# EAGLE design RadioHTC_DISP (EAGLE 7.7.0)
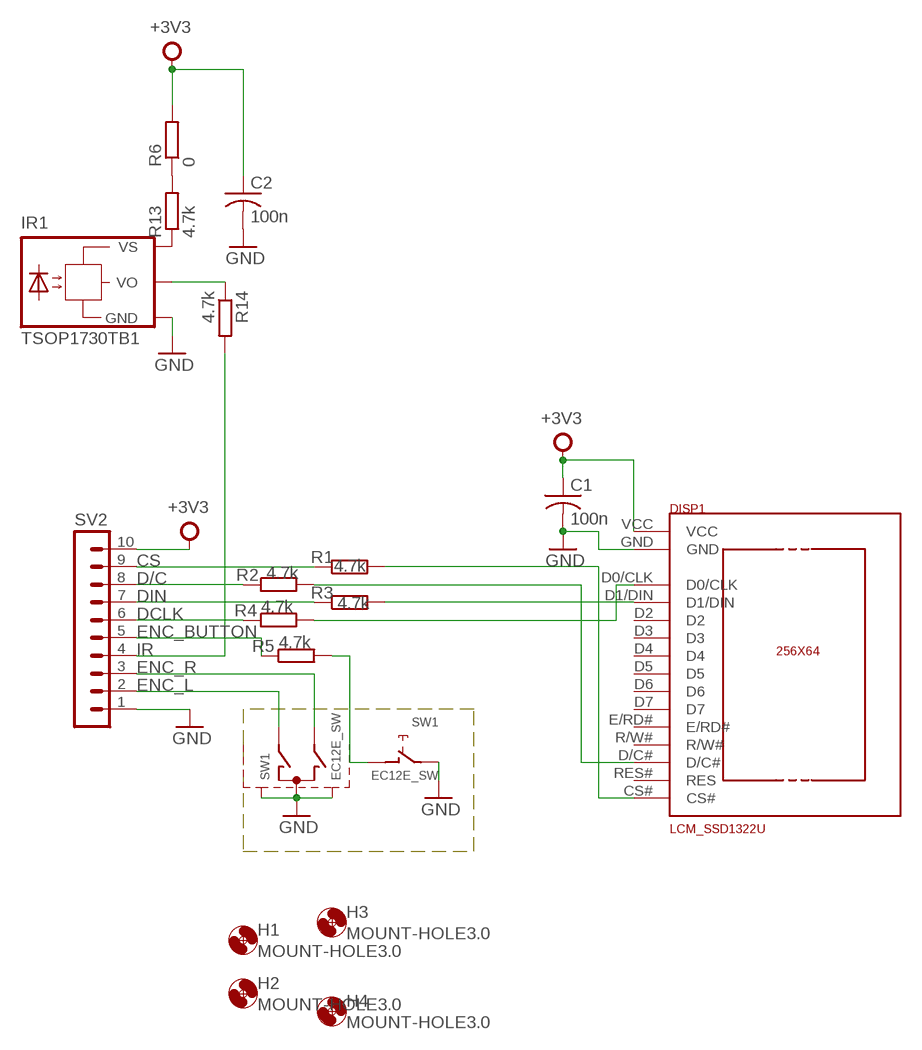
[diagram p0: schematic, sheet 1]

## Parts
C1  100n  C-USC1206  [C1206]
C2  100n  C-USC1206  [C1206]
DISP1  LCM_SSD1322U  [LCM_SSD1322_VERT]
H1  MOUNT-HOLE3.0  [3,0]
H2  MOUNT-HOLE3.0  [3,0]
H3  MOUNT-HOLE3.0  [3,0]
H4  MOUNT-HOLE3.0  [3,0]
IR1  TSOP1730TB1  [TSOP17_TB1]
R1  4.7k  R-EU_R1206  [R1206]
R2  4.7k  R-EU_R1206  [R1206]
R3  4.7k  R-EU_R1206  [R1206]
R4  4.7k  R-EU_R1206  [R1206]
R5  4.7k  R-EU_R1206  [R1206]
R6  0  R-EU_R1206  [R1206]
R13  4.7k  R-EU_R1206  [R1206]
R14  4.7k  R-EU_R1206  [R1206]
SV2  MA10-1  [MA10-1]
SW1  EC12E_SW  [ALPS_EC12E_SW]

## Nets
+3V3: C1.1 C2.1 DISP1.VCC R6.2 SV2.10
CS: R1.1 SV2.9
CS#: DISP1.CS# R1.2
D/C: R2.1 SV2.8
DC_: DISP1.D/C# R2.2
DCLK: R4.1 SV2.6
DCLK_: DISP1.D0/CLK R4.2
DIN: R3.1 SV2.7
DIN_: DISP1.D1/DIN R3.2
ENC_BUTTON: R5.1 SV2.5
ENC_L: SV2.2 SW1.A
ENC_R: SV2.3 SW1.B
GND: C1.2 C2.2 DISP1.GND IR1.GND SV2.1 SW1.C SW1.E SW1.GND@1 SW1.GND@2
IR: R14.2 SV2.4
N$1: R5.2 SW1.D
N$2: R6.1 R13.2
N$44: IR1.VS R13.1
N$47: IR1.VO R14.1
Unconnected: DISP1.D2 DISP1.D3 DISP1.D4 DISP1.D5 DISP1.D6 DISP1.D7 DISP1.E/RD# DISP1.R/W# DISP1.RES#(RES)

## Library data of the parts
C1 C2 = rcl-2:C-US: CAPACITOR, American symbol
DISP1 = vfds:LCM_SSD1322U
H1-H4 = holes:MOUNT-HOLE: MOUNTING HOLE with drill center marker
IR1 = telefunken:TSOP17*TB1: TSOP17..TB1 IR Receiver Modules for Remote Control Systems Source: http://www.vishay.com/docs/82042/82042.pdf; OC_FARNELL: unknown; OC_NEWARK: unknown
R1-R6 R13 R14 = rcl:R-EU_: RESISTOR, European symbol
SV2 = con-lstb:MA10-1: PIN HEADER; OC_FARNELL: unknown; OC_NEWARK: unknown
SW1 = vfds:EC12E_SW: ALPS rotary Encoder EC12E series with switch; MPN: EC12E2424407; OC_FARNELL: 1520813; OC_NEWARK: 74M1068

## Board
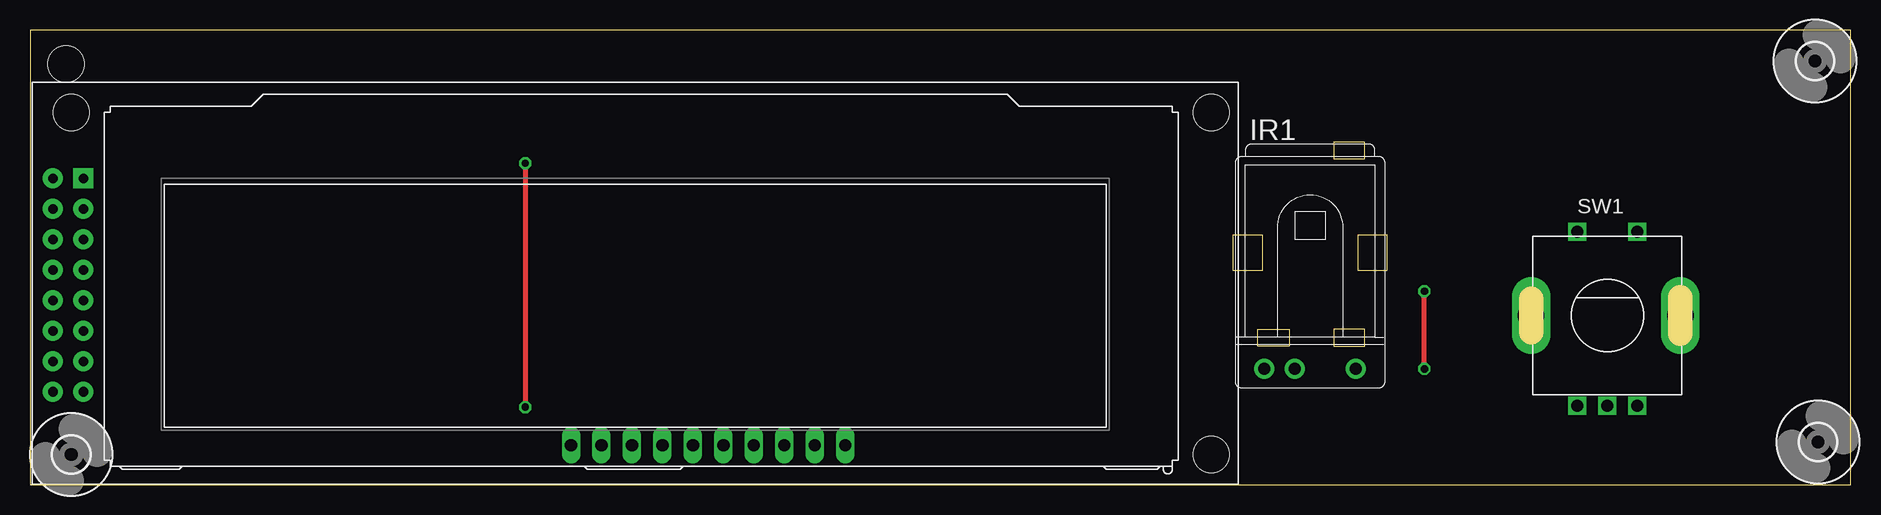
[diagram p1: board, top side]
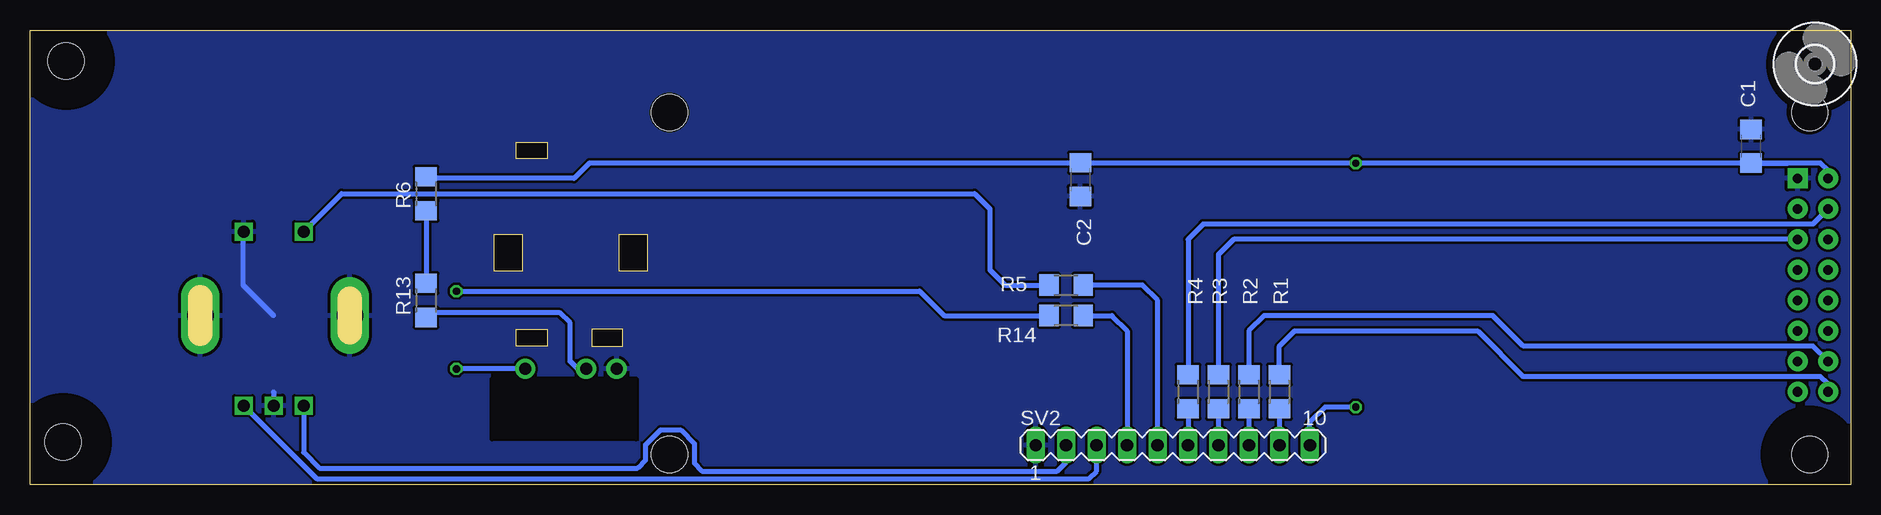
[diagram p2: board, bottom side, seen from below]

Size 151.75 x 37.88 mm. Coordinates in mm from the lower left corner, seen from the top.
Outline: 0,0 151.75,0 151.75,37.88 0,37.88 0,0
Copper layers (1*16): Top 0.035mm / dielectric 1.5mm / Bottom 0.035mm
Design rules "default *": minimum track width 10mil, minimum drill 24mil, track to track 8mil, track to pad 8mil, pad to pad 8mil, via to via 8mil, smd to smd 0mil, copper to edge 2mil, drill to drill 8mil, minimum pad ring 10mil, minimum via ring 8mil, stop-mask expansion 4mil, vias tented up to drill 0mil, thermal gap 10mil
bRestrict: area 97,29.6 to 100,32.6; area 1.7,29.3 to 5.3,32.9; 4 lines

### Footprints (pad centres in the part's own frame; a part is rotated, then mirrored left to right if it is on the bottom)
C1206 = smd 1.6 x 1.8: 1 -1.4,0; 2 1.4,0
LCM_SSD1322_VERT = drill 0.8 pad 1.676: CS# 2.54,17.78; D0/CLK 2.54,2.54; D1/DIN 0,5.08; D2 2.54,5.08; D3 0,7.62; D4 2.54,7.62; D5 0,10.16; D6 2.54,10.16; D7 0,12.7; D/C# 2.54,15.24; E/RD# 2.54,12.7; P$3 0,2.54; R/W# 0,15.24; RES# 0,17.78; VCC 2.54,0 | drill 0.8 pad 1.676 square: GND 0,0 | hole 3: -94,-5.5; 1,-5.5; 1,23; -94,23
3,0 = hole 3: 0,0
TSOP17_TB1 = drill 1 pad 1.676: GND 0,-3.81; VO 0,3.81; VS 0,-1.27
R1206 = smd 1.6 x 1.803: 1 -1.422,0; 2 1.422,0
MA10-1 = drill 1.016 long: 1 -11.43,0; 2 -8.89,0; 3 -6.35,0; 4 -3.81,0; 5 -1.27,0; 6 1.27,0; 7 3.81,0; 8 6.35,0; 9 8.89,0; 10 11.43,0
ALPS_EC12E_SW = drill 1 square: A -2.5,-7.5; B 2.5,-7.5; C 0,-7.5; D -2.5,7; E 2.5,7 | drill 2.2 long: GND@1 -6.35,-0.004; GND@2 6.096,0.004

### Placement (x,y rotation side)
C1  8.31,28.2 90 bottom
C2  64.22,25.41 270 bottom
DISP1  4.44,25.52 180 top
H1  149,3.56 0 top
H2  2.99,35.05 0 bottom
H3  148.75,35.3 0 top
H4  3.44,2.51 0 top
IR1  106.68,9.64 270 top
R1  47.62,7.73 90 bottom
R2  50.16,7.73 90 bottom
R3  52.7,7.73 90 bottom
R4  55.24,7.73 90 bottom
R5  65.41,16.62 180 bottom
R6  118.75,24.25 90 bottom
R13  118.75,15.36 90 bottom
R14  65.41,14.09 0 bottom
SV2  56.51,3.29 0 bottom
SW1  131.44,14.09 0 top

### Tracks (layer width: path | path; a pad name or v marks a point on that pad's centre or on a via)
+3V3  (via drill 0.6)
  Top 0.406: v41.27,26.79 v41.27,6.46
  Bottom 0.406: 5.24,26.79 2.54,26.79 1.9,26.15 DISP1.VCC | 5.24,26.79 v41.27,26.79 62.74,26.79 | 62.74,26.79 105.12,26.79 106.4,25.52 118.59,25.52 R6.2 | v41.27,6.46 43.81,6.46 45.09,5.2 SV2.10 | C1.1 5.25,26.79 5.24,26.79 | C2.1 62.77,26.82 62.74,26.79
CS
  Bottom 0.406: R1.1 SV2.9
CS#
  Bottom 0.406: R1.2 47.62,11.54 46.35,12.82 31.11,12.82 27.3,9 2.54,9 1.9,8.37 DISP1.CS#
D/C
  Bottom 0.406: R2.1 SV2.8
DC_
  Bottom 0.406: R2.2 50.16,12.82 48.89,14.09 29.84,14.09 27.3,11.54 3.17,11.54 DISP1.D/C#
DCLK
  Bottom 0.406: R4.1 SV2.6
DCLK_
  Bottom 0.406: DISP1.D0/CLK 3.17,21.7 53.97,21.7 55.24,20.43 R4.2
DIN
  Bottom 0.406: R3.1 SV2.7
DIN_
  Bottom 0.406: DISP1.D1/DIN 51.43,20.43 52.7,19.16 R3.2
ENC_BUTTON
  Bottom 0.406: SV2.5 57.79,15.36 59.05,16.62 R5.1
ENC_L
  Bottom 0.406: SW1.A 128.94,2.69 127.63,1.39 101.1,1.39 100.47,2.02 100.47,3.29 99.2,4.56 97.52,4.56 96.39,3.43 96.39,1.77 95.75,1.14 66.16,1.14 65.41,1.89 SV2.2
ENC_R
  Bottom 0.406: SW1.B 127.86,0.5 63.5,0.5 62.87,1.14 SV2.3 62.87,1.39
GND
  Bottom 0.406: 131.44,14.09 133.99,16.62 133.99,21.04 SW1.E | 131.44,7.73 SW1.C
  pour Bottom: -0.64,38.21 151.77,38.21 151.77,17.89 151.77,0.12 -0.64,0.12
IR
  Bottom 0.406: R14.2 61.59,14.09 60.32,12.82 SV2.4
N$1
  Bottom 0.406: SW1.D 125.78,24.25 73.03,24.25 71.76,22.98 71.76,17.89 70.48,16.62 R5.2
N$2
  Bottom 0.406: 118.75,22.98 R6.1 R13.2
N$44
  Bottom 0.406: R13.1 118.75,14.03 118.46,14.32 107.59,14.32 106.75,13.48 106.75,10.28 106.11,9.64 IR1.VS
N$47  (via drill 0.6)
  Top 0.406: v116.2,9.64 v116.2,16.12
  Bottom 0.406: IR1.VO v116.2,9.64 | R14.1 75.56,14.09 77.61,16.12 v116.2,16.12

### Text on the board
Document: A | A | volume | selector | speakers | aux | b | bass | treble | balance | tuner | phono | a | a+b | 0 | 0 | 0 | power | 2 | 2 | 2 | 2 | filters | 4 | 4 | 4 | 4 | 0 | 6 | 6 | 6 | 6 | high | low | 8 | 8 | 8 | 8 | phones | - 10 | 10 + | - 10 | 10 + | left | right | right | UNITRA | FONICA | STEREO INTEGRATED AMPLIFIER PW 9013